# Altium schematic sheet Yboard.schdoc
size 552 x 308 mm
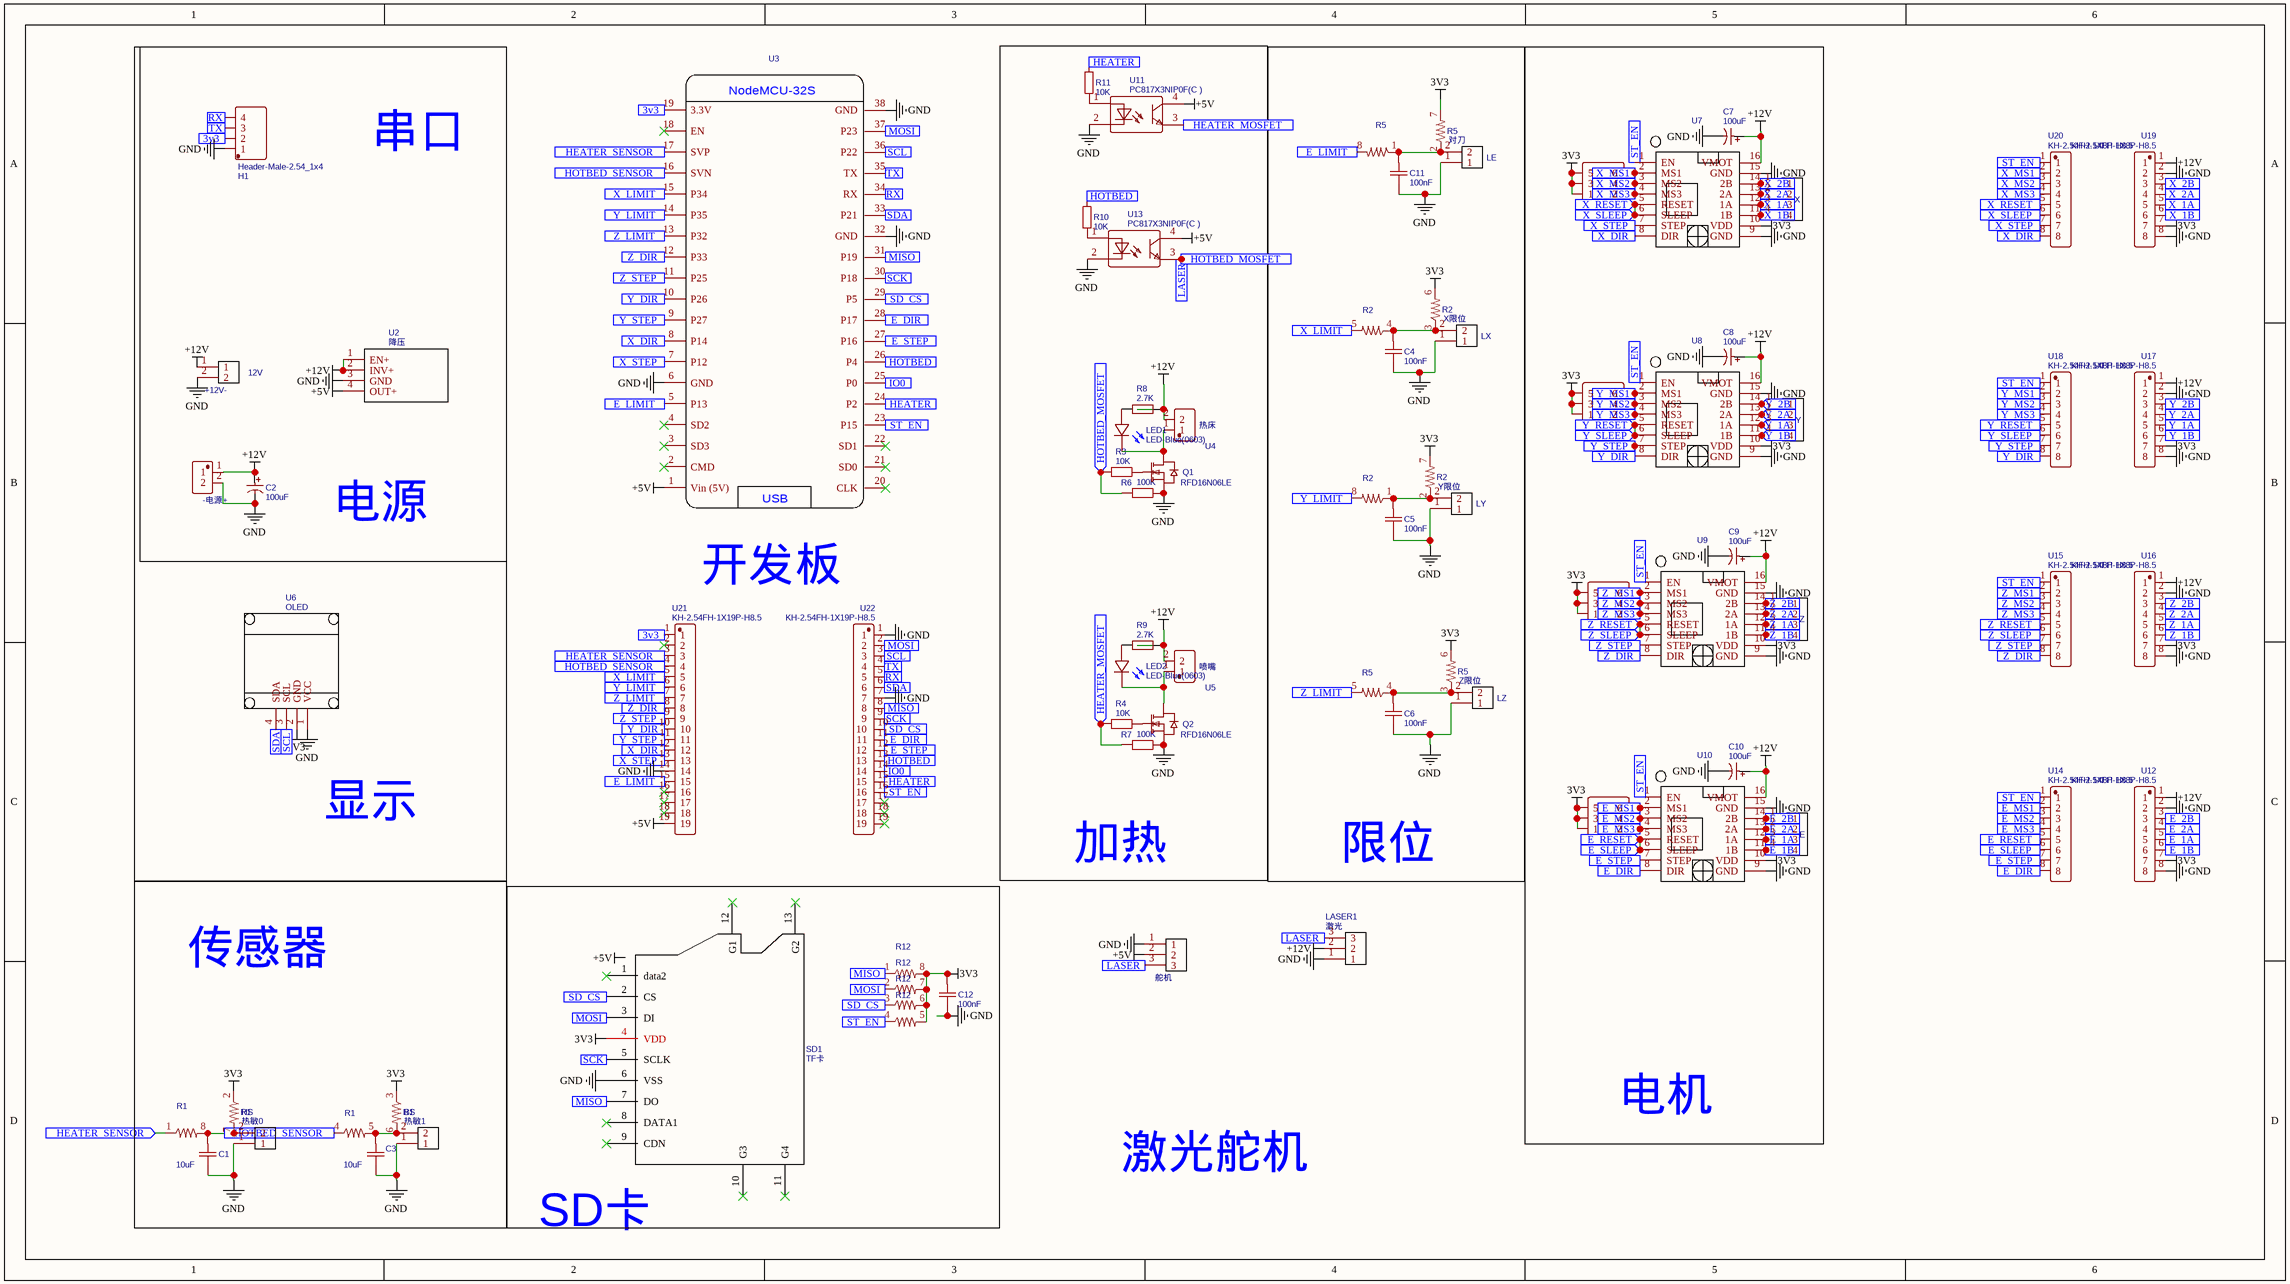
[diagram p0: Yboard.schdoc]

## Parts
(Parts that share a designator on the sheet are numbered #1, #2 ... from top to bottom, then left to right.)
12V  +12V-  [CONN-TH_XH-2A]
BS  热敏1  [CONN-TH_XH-2A]
C1  10uF  [C0603]
C2  100uF  [CAP-D6.3XH7.7]
C3  10uF  [C0603]
C4  100nF  [C0603]
C5  100nF  [C0603]
C6  100nF  [C0603]
C7  100uF  [CAP-D6.3XH7.7]
C8  100uF  [CAP-D6.3XH7.7]
C9  100uF  [CAP-D6.3XH7.7]
C10  100uF  [CAP-D6.3XH7.7]
C11  100nF  [C0603]
C12  100nF  [C0603]
E  E轴  [CONN-TH_4P-P2.50_XH-4A]  (value not drawn)
H1  Header-Male-2.54_1x4  [HDR-TH_4P-P2.54-V]
HS  热敏0  [CONN-TH_XH-2A]
J1  Header-Male-2.54_2x3  [HDR-TH_6P-P2.54-V-R2-C3-S2.54]  (value not drawn)
J2  Header-Male-2.54_2x3  [HDR-TH_6P-P2.54-V-R2-C3-S2.54]  (value not drawn)
J3  Header-Male-2.54_2x3  [HDR-TH_6P-P2.54-V-R2-C3-S2.54]  (value not drawn)
J4  Header-Male-2.54_2x3  [HDR-TH_6P-P2.54-V-R2-C3-S2.54]  (value not drawn)
LASER1  激光  [CONN-TH_XH-3A]
LE  对刀  [CONN-TH_XH-2A]
LED1  LED-Blue(0603)  [LED-0603-R]
LED2  LED-Blue(0603)  [LED-0603-R]
LX  X限位  [CONN-TH_XH-2A]
LY  Y限位  [CONN-TH_XH-2A]
LZ  Z限位  [CONN-TH_XH-2A]
Q1  RFD16N06LE  [TO-252-2_L6.6-W6.1-P4.57-LS9.9-BR-CW]
Q2  RFD16N06LE  [TO-252-2_L6.6-W6.1-P4.57-LS9.9-BR-CW]
R1#1  RESISTOR-ARRAY0603-ARV  [0603-ARV]  (value not drawn)
R1#2  RESISTOR-ARRAY0603-ARV  [0603-ARV]  (value not drawn)
R1#3  RESISTOR-ARRAY0603-ARV  [0603-ARV]  (value not drawn)
R1#4  RESISTOR-ARRAY0603-ARV  [0603-ARV]  (value not drawn)
R2#1  RESISTOR-ARRAY0603-ARV  [0603-ARV]  (value not drawn)
R2#2  RESISTOR-ARRAY0603-ARV  [0603-ARV]  (value not drawn)
R2#3  RESISTOR-ARRAY0603-ARV  [0603-ARV]  (value not drawn)
R2#4  RESISTOR-ARRAY0603-ARV  [0603-ARV]  (value not drawn)
R3  10K  [R0805]
R4  10K  [R0805]
R5#1  RESISTOR-ARRAY0603-ARV  [0603-ARV]  (value not drawn)
R5#2  RESISTOR-ARRAY0603-ARV  [0603-ARV]  (value not drawn)
R5#3  RESISTOR-ARRAY0603-ARV  [0603-ARV]  (value not drawn)
R5#4  RESISTOR-ARRAY0603-ARV  [0603-ARV]  (value not drawn)
R6  100K  [R0805]
R7  100K  [R0805]
R8  2.7K  [R0603]
R9  2.7K  [R0603]
R10  10K  [R0603]
R11  10K  [R0603]
R12#1  RESISTOR-ARRAY0603-ARV  [0603-ARV]  (value not drawn)
R12#2  RESISTOR-ARRAY0603-ARV  [0603-ARV]  (value not drawn)
R12#3  RESISTOR-ARRAY0603-ARV  [0603-ARV]  (value not drawn)
R12#4  RESISTOR-ARRAY0603-ARV  [0603-ARV]  (value not drawn)
SD1  TF卡  [TF卡带孔]
SERVO  舵机  [HDR-3X1/2.54]
U1  -电源+  [CONN-TH_P5.08_KF127-5.08-2P]
U2  降压  [DC_MOUDLE]
U3  NodeMCU-32SLua  [AI-THINKER_NODEMCU-32SLUA]  (value not drawn)
U4  热床  [CONN-TH_P5.08_KF127-5.08-2P]
U5  喷嘴  [CONN-TH_P5.08_KF127-5.08-2P]
U6  OLED  [0.96寸OLED模块I2C]
U7  4988  [A4988 STEPPER MOTOR DRIVER CARRIER]  (value not drawn)
U8  4988  [A4988 STEPPER MOTOR DRIVER CARRIER]  (value not drawn)
U9  4988  [A4988 STEPPER MOTOR DRIVER CARRIER]  (value not drawn)
U10  4988  [A4988 STEPPER MOTOR DRIVER CARRIER]  (value not drawn)
U11  PC817X3NIP0F(C )  [OPTO-SMD-4_L4.6-W6.5-P2.54-LS10.3-BL]
U12  KH-2.54FH-1X8P-H8.5  [HDR-TH_8P-P2.54-V-F]
U13  PC817X3NIP0F(C )  [OPTO-SMD-4_L4.6-W6.5-P2.54-LS10.3-BL]
U14  KH-2.54FH-1X8P-H8.5  [HDR-TH_8P-P2.54-V-F]
U15  KH-2.54FH-1X8P-H8.5  [HDR-TH_8P-P2.54-V-F]
U16  KH-2.54FH-1X8P-H8.5  [HDR-TH_8P-P2.54-V-F]
U17  KH-2.54FH-1X8P-H8.5  [HDR-TH_8P-P2.54-V-F]
U18  KH-2.54FH-1X8P-H8.5  [HDR-TH_8P-P2.54-V-F]
U19  KH-2.54FH-1X8P-H8.5  [HDR-TH_8P-P2.54-V-F]
U20  KH-2.54FH-1X8P-H8.5  [HDR-TH_8P-P2.54-V-F]
U21  KH-2.54FH-1X19P-H8.5  [HDR-TH_19P-P2.54-V-F]
U22  KH-2.54FH-1X19P-H8.5  [HDR-TH_19P-P2.54-V-F]
X  X轴  [CONN-TH_XH-4A]  (value not drawn)
Y  Y轴  [CONN-TH_4P-P2.50_XH-4A]  (value not drawn)
Z  Z轴  [CONN-TH_4P-P2.50_XH-4A]  (value not drawn)

## Blocks framed on the sheet
加热: LED1 LED2 Q1 Q2 R3 R4 R6-R11 U4 U5 U11 U13
限位: C4-C6 C11 LE LX LY LZ R2#1-R2#4 R5#1-R5#4
电机: C7-C10 E J1-J4 U7-U10 X Y Z
传感器: BS C1 C3 HS R1#1-R1#4

## Ports
3v3 (in), E_1A (in), E_1B (in), E_2A (in), E_2B (in), E_DIR (in), E_LIMIT (in), E_MS1 (in), E_MS2 (in), E_MS3 (in), E_RESET (in), E_SLEEP (in), E_STEP (in), HEATER (in), HEATER_MOSFET (in), HEATER_SENSOR (in), HOTBED (in), HOTBED_MOSFET (in), HOTBED_SENSOR (in), IO0 (in), LASER (in), MISO (in), MOSI (in), RX (in), SCK (in), SCL (in), SD_CS (in), SDA (in), ST_EN (in), TX (in), X_1A (in), X_1B (in), X_2A (in), X_2B (in), X_DIR (in), X_LIMIT (in), X_MS1 (in), X_MS2 (in), X_MS3 (in), X_RESET (in), X_SLEEP (in), X_STEP (in), Y_1A (in), Y_1B (in), Y_2A (in), Y_2B (in), Y_DIR (in), Y_LIMIT (in), Y_MS1 (in), Y_MS2 (in), Y_MS3 (in), Y_RESET (in), Y_SLEEP (in), Y_STEP (in), Z_1A (in), Z_1B (in), Z_2A (in), Z_2B (in), Z_DIR (in), Z_LIMIT (in), Z_MS1 (in), Z_MS2 (in), Z_MS3 (in), Z_RESET (in), Z_SLEEP (in), Z_STEP (in)

## Nets
3V3: C12.2 J1.1 J1.3 J1.5 J2.1 J2.3 J2.5 J3.1 J3.3 J3.5 J4.1 J4.3 J4.5 R1#1.2 R1#2.3 R2#1.6 R2#3.7 R5#1.7 R5#3.6 R12#1.8 R12#2.7 R12#3.6 R12#4.5 SD1.4(VDD) U6.2(GND) U7.10(VDD) U8.10(VDD) U9.10(VDD) U10.10(VDD) U12.7 U16.7 U17.7 U19.7
+5V: SERVO.2 U2.4(OUT+) U3.1(Vin_(5V)) U11.4(COL) U13.4(COL) U21.19
+12V: 12V.1 C2.1 C7.1 C8.1 C9.1 C10.1 LASER1.2 R8.2 R9.2 U1.1 U2.1(EN+) U2.2(INV+) U4.2 U5.2 U7.16(VMOT) U8.16(VMOT) U9.16(VMOT) U10.16(VMOT) U12.1 U16.1 U17.1 U19.1
GND: 12V.2 BS.1 C1.1 C2.2 C3.1 C4.1 C5.1 C6.1 C7.2 C8.2 C9.2 C10.2 C11.1 C12.1 H1.1 HS.1 LASER1.1 LE.1 LX.1 LY.1 LZ.1 Q1.3(S) Q2.3(S) R6.1 R7.1 SD1.6(VSS) SERVO.1 U1.2 U2.3(GND) U3.6(GND) U3.32(GND) U3.38(GND) U6.1(VCC) U7.9(GND) U7.15(GND) U8.9(GND) U8.15(GND) U9.9(GND) U9.15(GND) U10.9(GND) U10.15(GND) U11.2(CAT) U12.2 U12.8 U13.2(CAT) U16.2 U16.8 U17.2 U17.8 U19.2 U19.8 U21.14 U22.1 U22.7
3v3: H1.2 U3.19(3.3V) U21.1 ; port 3v3  [a separate net that carries the same name]
E_1A: E.3 U10.12(1A) U12.5 ; port E_1A
E_1B: E.4 U10.11(1B) U12.6 ; port E_1B
E_2A: E.2 U10.13(2A) U12.4 ; port E_2A
E_2B: E.1 U10.14(2B) U12.3 ; port E_2B
E_DIR: U3.28(P17) U10.8(DIR) U14.8 U22.11 ; port E_DIR
E_LIMIT: R5#2.8 U3.5(P13) U21.15 ; port E_LIMIT
E_MS1: J4.6 U10.2(MS1) U14.2 ; port E_MS1
E_MS2: J4.4 U10.3(MS2) U14.3 ; port E_MS2
E_MS3: J4.2 U10.4(MS3) U14.4 ; port E_MS3
E_RESET: U10.5(RESET) U10.6(SLEEP) U14.5 U14.6 ; port E_SLEEP, port E_RESET
E_STEP: U3.27(P16) U10.7(STEP) U14.7 U22.12 ; port E_STEP
HEATER: R11.2 U3.24(P2) U22.15 ; port HEATER
HEATER_MOSFET: R4.1 R7.2 U11.3(EM) ; port HEATER_MOSFET
HEATER_SENSOR: R1#3.1 U3.17(SVP) U21.3 ; port HEATER_SENSOR
HOTBED: R10.2 U3.26(P4) U22.13 ; port HOTBED
HOTBED_MOSFET: LASER1.3 R3.1 R6.2 SERVO.3 U13.3(EM) ; port HOTBED_MOSFET, port LASER
HOTBED_SENSOR: C1.2 HS.2 R1#1.7 R1#3.8 R1#4.4 U3.16(SVN) U21.4 ; port HOTBED_SENSOR
IO0: U3.25(P0) U22.14 ; port IO0
MISO: R12#1.1 SD1.7(DO) U3.31(P19) U22.8 ; port MISO
MOSI: R12#2.2 SD1.3(DI) U3.37(P23) U22.2 ; port MOSI
RX: H1.4 U3.34(RX) U22.5 ; port RX
SCK: SD1.5(SCLK) U3.30(P18) U22.9 ; port SCK
SCL: U3.36(P22) U6.3(SCL) U22.3 ; port SCL
SD_CS: R12#3.3 SD1.2(CS) U3.29(P5) U22.10 ; port SD_CS
SDA: U3.33(P21) U6.4(SDA) U22.6 ; port SDA
ST_EN: R12#4.4 U3.23(P15) U7.1(EN) U8.1(EN) U9.1(EN) U10.1(EN) U14.1 U15.1 U18.1 U20.1 U22.16 ; port ST_EN
TX: H1.3 U3.35(TX) U22.4 ; port TX
X_1A: U7.12(1A) U19.5 X.3 ; port X_1A
X_1B: U7.11(1B) U19.6 X.4 ; port X_1B
X_2A: U7.13(2A) U19.4 X.2 ; port X_2A
X_2B: U7.14(2B) U19.3 X.1 ; port X_2B
X_DIR: U3.8(P14) U7.8(DIR) U20.8 U21.12 ; port X_DIR
X_LIMIT: R2#2.5 U3.15(P34) U21.5 ; port X_LIMIT
X_MS1: J1.6 U7.2(MS1) U20.2 ; port X_MS1
X_MS2: J1.4 U7.3(MS2) U20.3 ; port X_MS2
X_MS3: J1.2 U7.4(MS3) U20.4 ; port X_MS3
X_RESET: U7.5(RESET) U7.6(SLEEP) U20.5 U20.6 ; port X_SLEEP, port X_RESET
X_STEP: U3.7(P12) U7.7(STEP) U20.7 U21.13 ; port X_STEP
Y_1A: U8.12(1A) U17.5 Y.3 ; port Y_1A
Y_1B: U8.11(1B) U17.6 Y.4 ; port Y_1B
Y_2A: U8.13(2A) U17.4 Y.2 ; port Y_2A
Y_2B: U8.14(2B) U17.3 Y.1 ; port Y_2B
Y_DIR: U3.10(P26) U8.8(DIR) U18.8 U21.10 ; port Y_DIR
Y_LIMIT: R2#4.8 U3.14(P35) U21.6 ; port Y_LIMIT
Y_MS1: J2.6 U8.2(MS1) U18.2 ; port Y_MS1
Y_MS2: J2.4 U8.3(MS2) U18.3 ; port Y_MS2
Y_MS3: J2.2 U8.4(MS3) U18.4 ; port Y_MS3
Y_RESET: U8.5(RESET) U8.6(SLEEP) U18.5 U18.6 ; port Y_RESET, port Y_SLEEP
Y_STEP: U3.9(P27) U8.7(STEP) U18.7 U21.11 ; port Y_STEP
Z_1A: U9.12(1A) U16.5 Z.3 ; port Z_1A
Z_1B: U9.11(1B) U16.6 Z.4 ; port Z_1B
Z_2A: U9.13(2A) U16.4 Z.2 ; port Z_2A
Z_2B: U9.14(2B) U16.3 Z.1 ; port Z_2B
Z_DIR: U3.12(P33) U9.8(DIR) U15.8 U21.8 ; port Z_DIR
Z_LIMIT: R5#4.5 U3.13(P32) U21.7 ; port Z_LIMIT
Z_MS1: J3.6 U9.2(MS1) U15.2 ; port Z_MS1
Z_MS2: J3.4 U9.3(MS2) U15.3 ; port Z_MS2
Z_MS3: J3.2 U9.4(MS3) U15.4 ; port Z_MS3
Z_RESET: U9.5(RESET) U9.6(SLEEP) U15.5 U15.6 ; port Z_SLEEP, port Z_RESET
Z_STEP: U3.11(P25) U9.7(STEP) U15.7 U21.9 ; port Z_STEP
NetBS_2: BS.2 C3.2 R1#2.6 R1#4.5
NetC4_2: C4.2 LX.2 R2#1.3 R2#2.4
NetC5_2: C5.2 LY.2 R2#3.2 R2#4.1
NetC6_2: C6.2 LZ.2 R5#3.3 R5#4.4
NetC11_2: C11.2 LE.2 R5#1.2 R5#2.1
NetLED1_1: LED1.1(+) R8.1
NetLED1_2: LED1.2(-) Q1.2(D) U4.1
NetLED2_1: LED2.1(+) R9.1
NetLED2_2: LED2.2(-) Q2.2(D) U5.1
NetQ1_1: Q1.1(G) R3.2
NetQ2_1: Q2.1(G) R4.2
NetR10_1: R10.1 U13.1(AN)
NetR11_1: R11.1 U11.1(AN)

Not connected (* = marked no-connect by the designer): SD1 1(data2)* 8(DATA1)* 9(CDN)* 10(G3)* 11(G4)* 12(G1)* 13(G2)*; U3 2(CMD)* 3(SD3)* 4(SD2)* 18(EN)* 20(CLK)* 21(SD0)* 22(SD1)*; U21 2* 16* 17* 18*; U22 17* 18* 19*

## Notes on the sheet
- 串口
- 电源
- 开发板
- 显示
- 激光舵机
- (near SD1) SD卡
- Labels drawn without touching a wire or pin: +5V
- (in symbol NodeMCU-32SLua) NodeMCU-32S; USB

## Library data of the parts
12V = +12V-: BOM_Manufacturer: BOOMELE; BOM_Manufacturer Part: XH-2A; BOM_Supplier: LCSC; image: //image.lceda.cn/szlcsc/C20079.jpg; BOM_Supplier Part: C20079; spicePre: C; spiceSymbolName: XH-2A
BS = 热敏1: BOM_Manufacturer: BOOMELE; BOM_Manufacturer Part: XH-2A; BOM_Supplier: LCSC; image: //image.lceda.cn/szlcsc/C20079.jpg; BOM_Supplier Part: C20079; spicePre: C; spiceSymbolName: XH-2A
C1 C3 = 10uF: BOM_Manufacturer: FH; BOM_Manufacturer Part: 0805F106M160NT; nameAlias: Capacitance; SMT Type: Extend; BOM_Supplier: LCSC; BOM_Supplier Part: C90545; BOM_JLCPCB SMD: Yes; spicePre: C; spiceSymbolName: 0805F106M160NT
C2 C7-C10 = 100uF: BOM_Manufacturer: CapXon; BOM_Manufacturer Part: HV101M025E077R; Voltage: 25V; BOM_EasyEDA: E59935; Value: 100uF; BOM_Supplier Part: E59935; BOM_Supplier: EasyEDA; spicePre: C; spiceSymbolName: 100uF
C4-C6 C11 C12 = 100nF: BOM_Manufacturer Part: GRM21BR71E104KA01L; BOM_Description: Cap, 0.1uF, 25V, X7R; Value: 100nF; spicePre: C; spiceSymbolName: 100nF
E = E轴: BOM_Manufacturer: BOOMELE; BOM_Manufacturer Part: XH-4A; BOM_Supplier: LCSC; image: //image.lceda.cn/szlcsc/C37815.jpg; BOM_Supplier Part: C37815; spicePre: C; spiceSymbolName: XH-4A
H1 = Header-Male-2.54_1x4: BOM_Manufacturer: Ckmtw; BOM_Manufacturer Part: 210S-1*4P L=11.6MMGold-plated black; Contributor: renyufei; SMT Type: Extend; BOM_Supplier: LCSC; BOM_Supplier Part: C124378; BOM_JLCPCB SMD: Yes; spicePre: H; spiceSymbolName: Header-Male-2.54_1x4
HS = 热敏0: BOM_Manufacturer: BOOMELE; BOM_Manufacturer Part: XH-2A; BOM_Supplier: LCSC; image: //image.lceda.cn/szlcsc/C20079.jpg; BOM_Supplier Part: C20079; spicePre: C; spiceSymbolName: XH-2A
J1-J4 = Header-Male-2.54_2x3: BOM_Manufacturer: BOOMELE; BOM_Supplier: LCSC; BOM_Manufacturer Part: Header-Male-2.54_2x3; BOM_Supplier Part: C65114; spicePre: J; spiceSymbolName: Header-Male-2.54_2x3
LASER1 = 激光: BOM_Manufacturer: BOOMELE; BOM_Manufacturer Part: XH-3A; BOM_Supplier: LCSC; image: //image.lceda.cn/szlcsc/C2316.jpg; BOM_Supplier Part: C2316; spicePre: C; spiceSymbolName: XH-3A
LE = 对刀: BOM_Manufacturer: BOOMELE; BOM_Manufacturer Part: XH-2A; BOM_Supplier: LCSC; image: //image.lceda.cn/szlcsc/C20079.jpg; BOM_Supplier Part: C20079; spicePre: C; spiceSymbolName: XH-2A
LED1 LED2 = LED-Blue(0603): BOM_Manufacturer: EVERLIGHT; BOM_Manufacturer Part: 19-217/BHC-ZL1M2RY/3T; BOM_Supplier: LCSC; BOM_Supplier Part: C72041; spicePre: L; spiceSymbolName: LED-Blue(0603)
LX = X限位: BOM_Manufacturer: BOOMELE; BOM_Manufacturer Part: XH-2A; BOM_Supplier: LCSC; image: //image.lceda.cn/szlcsc/C20079.jpg; BOM_Supplier Part: C20079; spicePre: C; spiceSymbolName: XH-2A
LY = Y限位: BOM_Manufacturer: BOOMELE; BOM_Manufacturer Part: XH-2A; BOM_Supplier: LCSC; image: //image.lceda.cn/szlcsc/C20079.jpg; BOM_Supplier Part: C20079; spicePre: C; spiceSymbolName: XH-2A
LZ = Z限位: BOM_Manufacturer: BOOMELE; BOM_Manufacturer Part: XH-2A; BOM_Supplier: LCSC; image: //image.lceda.cn/szlcsc/C20079.jpg; BOM_Supplier Part: C20079; spicePre: C; spiceSymbolName: XH-2A
Q1 Q2 = RFD16N06LE: BOM_Manufacturer: VBsemi Elec; Contributor: LCSC; BOM_Supplier: LCSC; BOM_Supplier Part: C710053; BOM_Manufacturer Part: RFD16N06LE; spicePre: Q; spiceSymbolName: RFD16N06LE
R1#1-R1#4 R2#1-R2#4 R5#1-R5#4 R12#1-R12#4 = RESISTOR-ARRAY0603-ARV: subpart_no: 1; description: Array Chip Resistor; Contributor: SparkFun; spicePre: R; spiceSymbolName: RESISTOR-ARRAY0603-ARV
R3 R4 R10 R11 = 10K: BOM_Manufacturer: ResistorToday; BOM_Manufacturer Part: AECR0805F100KK9; nameAlias: Resistance (Ohms); Contributor: LCSC; BOM_Supplier: LCSC; BOM_Supplier Part: C328379; spicePre: R; spiceSymbolName: AECR0805F100KK9
R6 R7 = 100K: BOM_Manufacturer: ResistorToday; BOM_Manufacturer Part: AECR0805F100KK9; nameAlias: Resistance (Ohms); Contributor: LCSC; BOM_Supplier: LCSC; BOM_Supplier Part: C328379; spicePre: R; spiceSymbolName: AECR0805F100KK9
R8 R9 = 2.7K: BOM_Manufacturer: UniOhm; BOM_Manufacturer Part: 0603WAF2701T5E; nameAlias: Resistance (Ohms); BOM_Supplier: LCSC; BOM_Supplier Part: C13167; BOM_JLCPCB Part Class: Basic Part; spicePre: R; spiceSymbolName: 0603WAF2701T5E
SD1 = TF卡: BOM_Manufacturer: LCSC; BOM_Manufacturer Part: TF-Card; BOM_Supplier: LCSC; BOM_Supplier Part: C12075; spicePre: S; spiceSymbolName: TF-Card
SERVO = 舵机: BOM_Manufacturer: BOOMELE; BOM_Manufacturer Part: XH-3A; BOM_Supplier: LCSC; image: //image.lceda.cn/szlcsc/C2316.jpg; BOM_Supplier Part: C2316; spicePre: C; spiceSymbolName: XH-3A
U1 = -电源+: BOM_Manufacturer: Cixi Kefa Elec; BOM_Manufacturer Part: KF127-5.08-2P; Contributor: LCSC; BOM_Supplier: LCSC; BOM_Supplier Part: C474906; spicePre: U; spiceSymbolName: KF127-5.08-2P
U2 = 降压: Contributor: renyufei; spicePre: U; spiceSymbolName: DC_MOUDLE
U3 = NodeMCU-32SLua: BOM_Manufacturer: Ai-Thinker; Contributor: EasyEDA; spicePre: X; BOM_Supplier: LCSC; BOM_Supplier Part: C111436; BOM_Manufacturer Part: NodeMCU-32SLua; link: https://lcsc.com/product-detail/Modules_NodeMCU-32S-Lua_C111436.html; spiceSymbolName: NodeMCU-32SLua
U4 = 热床: BOM_Manufacturer: Cixi Kefa Elec; BOM_Manufacturer Part: KF127-5.08-2P; Contributor: LCSC; BOM_Supplier: LCSC; BOM_Supplier Part: C474906; spicePre: U; spiceSymbolName: KF127-5.08-2P
U5 = 喷嘴: BOM_Manufacturer: Cixi Kefa Elec; BOM_Manufacturer Part: KF127-5.08-2P; Contributor: LCSC; BOM_Supplier: LCSC; BOM_Supplier Part: C474906; spicePre: U; spiceSymbolName: KF127-5.08-2P
U6 = OLED: BOM_Manufacturer Part: oled-0.96-4p-i2c; Contributor: zhangqingtao; BOM_Supplier Part: undefined; spicePre: U; spiceSymbolName: OLED_0.96_4P_ZJY_NEW
U7-U10 = 4988: BOM_Manufacturer Part: New SchematicLib; Contributor: YunChe; spicePre: U; spiceSymbolName: 4988
U11 U13 = PC817X3NIP0F(C ): BOM_Manufacturer: SHARP; BOM_Supplier: LCSC; BOM_Manufacturer Part: PC817X3NIP0F(C ); BOM_Supplier Part: C95782; BOM_JLCPCB Part Class: Extended Part; spicePre: U; spiceSymbolName: PC817X3NIP0F(C )
U12 U14-U20 = KH-2.54FH-1X8P-H8.5: BOM_Manufacturer: kinghelm(金航标); Contributor: LCSC; BOM_Supplier: LCSC; BOM_Supplier Part: C2905417; BOM_Manufacturer Part: KH-2.54FH-1X8P-H8.5; spicePre: U; spiceSymbolName: KH-2.54FH-1X8P-H8.5
U21 U22 = KH-2.54FH-1X19P-H8.5: BOM_Manufacturer: kinghelm(金航标); Contributor: LCSC; BOM_Supplier: LCSC; BOM_Supplier Part: C2932678; BOM_Manufacturer Part: KH-2.54FH-1X19P-H8.5; spicePre: U; spiceSymbolName: KH-2.54FH-1X19P-H8.5
X = X轴: BOM_Manufacturer: BOOMELE; BOM_Manufacturer Part: XH-4A; BOM_Supplier: LCSC; image: //image.lceda.cn/szlcsc/C37815.jpg; BOM_Supplier Part: C37815; spicePre: C; spiceSymbolName: XH-4A
Y = Y轴: BOM_Manufacturer: BOOMELE; BOM_Manufacturer Part: XH-4A; BOM_Supplier: LCSC; image: //image.lceda.cn/szlcsc/C37815.jpg; BOM_Supplier Part: C37815; spicePre: C; spiceSymbolName: XH-4A
Z = Z轴: BOM_Manufacturer: BOOMELE; BOM_Manufacturer Part: XH-4A; BOM_Supplier: LCSC; image: //image.lceda.cn/szlcsc/C37815.jpg; BOM_Supplier Part: C37815; spicePre: C; spiceSymbolName: XH-4A